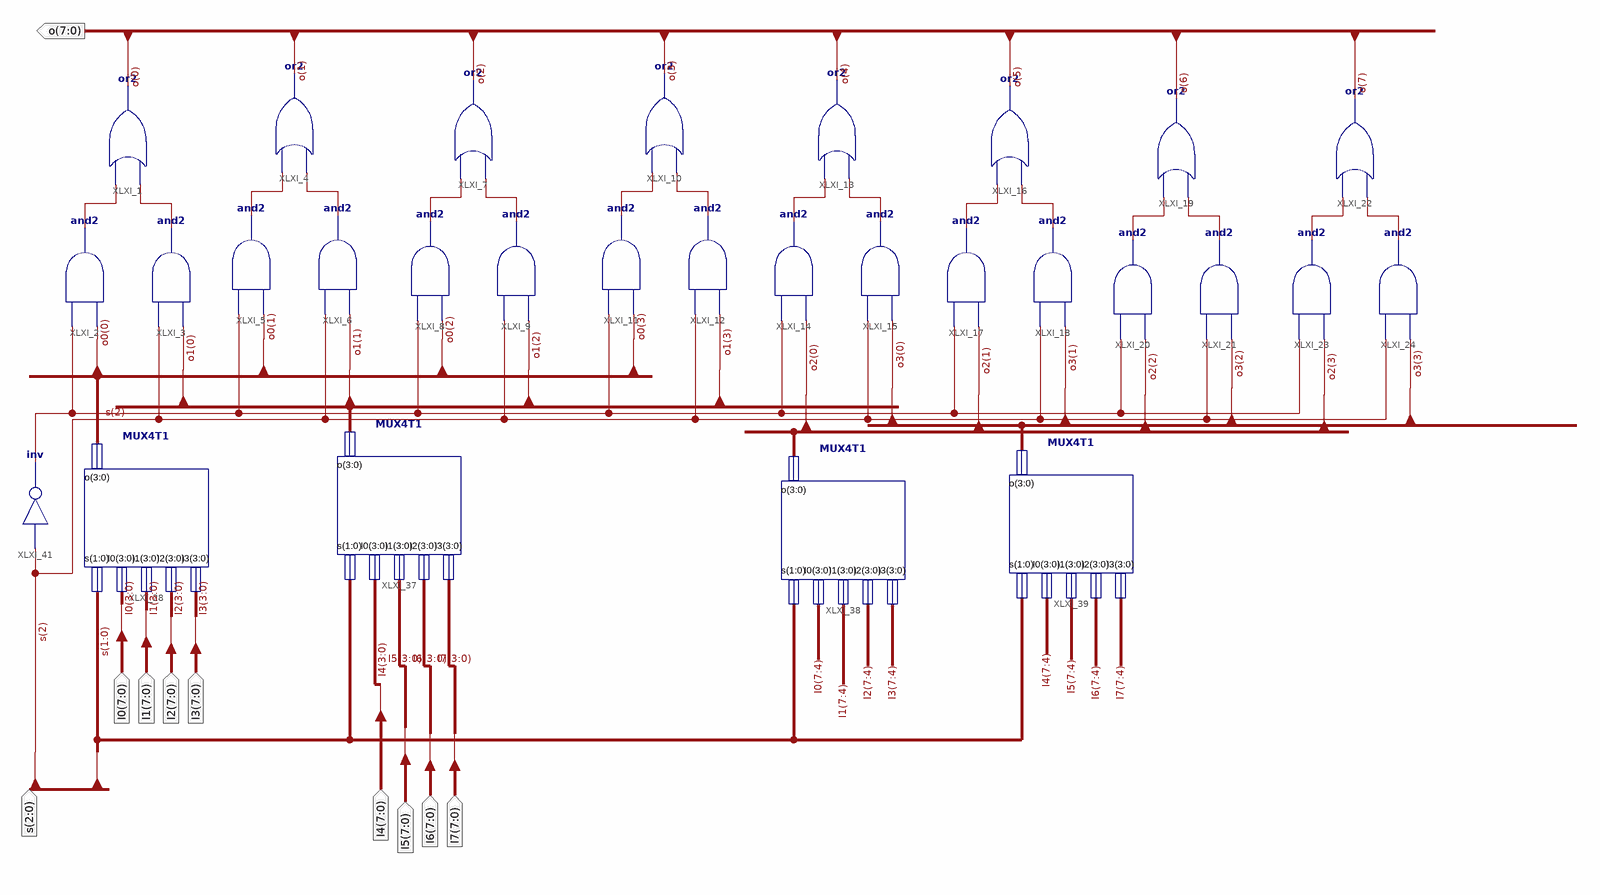
[diagram p0: schematic sheet 1]
// Xilinx ISE schematic MUX8T1_8.sch (kintex7) as structural Verilog: 29 symbols, 10 ports
module MUX8T1_8 (
  input  [7:0] I0,
  input  [7:0] I1,
  input  [7:0] I2,
  input  [7:0] I3,
  input  [7:0] I4,
  input  [7:0] I5,
  input  [7:0] I6,
  input  [7:0] I7,
  input  [2:0] s,
  output [7:0] o
);

  wire XLXN_1, XLXN_2, XLXN_6, XLXN_7, XLXN_8, XLXN_9, XLXN_10, XLXN_11, XLXN_12, XLXN_13, XLXN_14, XLXN_15,
       XLXN_16, XLXN_17, XLXN_18, XLXN_19, XLXN_135;
  wire [3:0] o0, o1, o2, o3;

  or XLXI_4 (o[1], XLXN_7, XLXN_6);
  and XLXI_5 (XLXN_6, o0[1], XLXN_135);
  and XLXI_6 (XLXN_7, o1[1], s[2]);
  or XLXI_7 (o[2], XLXN_9, XLXN_8);
  and XLXI_8 (XLXN_8, o0[2], XLXN_135);
  and XLXI_9 (XLXN_9, o1[2], s[2]);
  or XLXI_10 (o[3], XLXN_11, XLXN_10);
  and XLXI_11 (XLXN_10, o0[3], XLXN_135);
  and XLXI_12 (XLXN_11, o1[3], s[2]);
  or XLXI_13 (o[4], XLXN_13, XLXN_12);
  and XLXI_14 (XLXN_12, o2[0], XLXN_135);
  and XLXI_15 (XLXN_13, o3[0], s[2]);
  or XLXI_16 (o[5], XLXN_15, XLXN_14);
  and XLXI_17 (XLXN_14, o2[1], XLXN_135);
  and XLXI_18 (XLXN_15, o3[1], s[2]);
  or XLXI_19 (o[6], XLXN_17, XLXN_16);
  and XLXI_20 (XLXN_16, o2[2], XLXN_135);
  and XLXI_21 (XLXN_17, o3[2], s[2]);
  or XLXI_22 (o[7], XLXN_19, XLXN_18);
  and XLXI_23 (XLXN_18, o2[3], XLXN_135);
  and XLXI_24 (XLXN_19, o3[3], s[2]);
  or XLXI_1 (o[0], XLXN_2, XLXN_1);
  and XLXI_2 (XLXN_1, o0[0], XLXN_135);
  and XLXI_3 (XLXN_2, o1[0], s[2]);
  MUX4T1 XLXI_38 (.s(s[1:0]), .I0(I0[7:4]), .I1(I1[7:4]), .I2(I2[7:4]), .I3(I3[7:4]), .o(o2));
  MUX4T1 XLXI_39 (.s(s[1:0]), .I0(I4[7:4]), .I1(I5[7:4]), .I2(I6[7:4]), .I3(I7[7:4]), .o(o3));
  MUX4T1 XLXI_28 (.s(s[1:0]), .I0(I0[3:0]), .I1(I1[3:0]), .I2(I2[3:0]), .I3(I3[3:0]), .o(o0));
  MUX4T1 XLXI_37 (.s(s[1:0]), .I0(I4[3:0]), .I1(I5[3:0]), .I2(I6[3:0]), .I3(I7[3:0]), .o(o1));
  not XLXI_41 (XLXN_135, s[2]);
endmodule
